# EAGLE schematic T2008_thermometre (EAGLE 9.6.2)
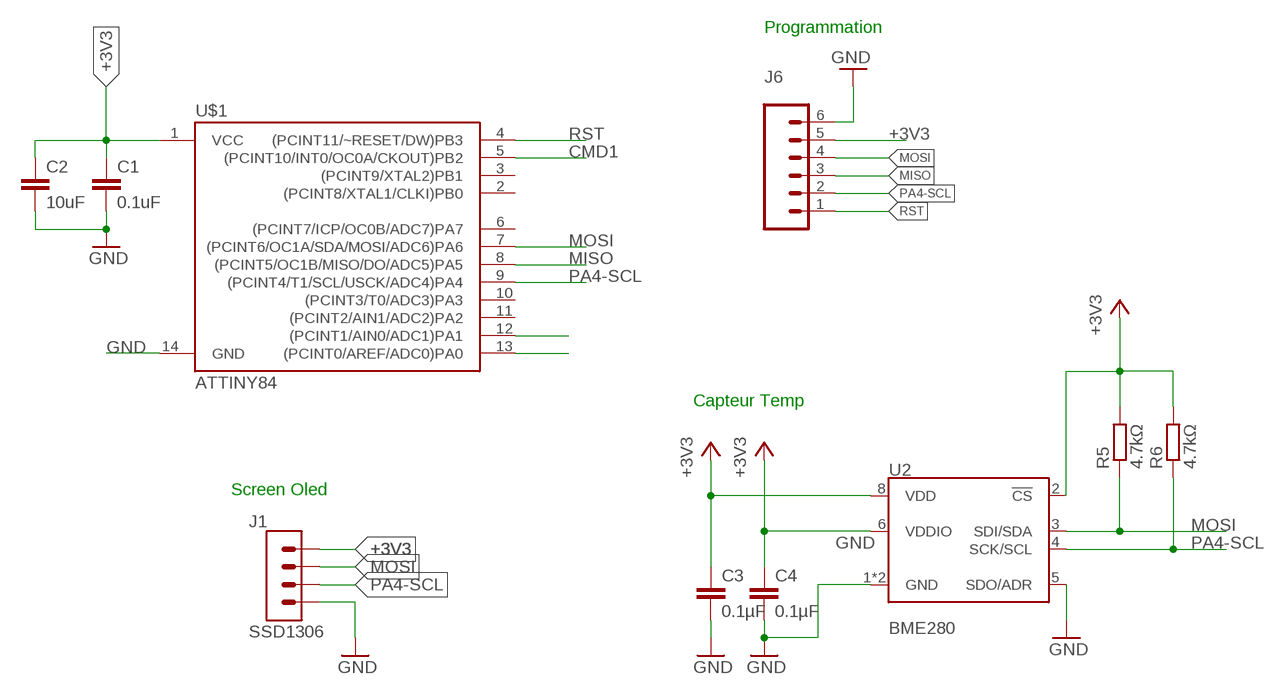
[diagram p0: schematic, sheet 1]

## Parts
C1  0.1uF  C-EUC0603K  [C0603K]
C2  10uF  C-EUC0603K  [C0603K]
C3  0.1µF  C-EUC0603K  [C0603K]
C4  0.1µF  C-EUC0603K  [C0603K]
J1  SSD1306  62000411121  [62000411121]
J6  CONN_06SMD_MALE  [1X06_SMD_MALE]
R5  4.7kΩ  R-EU_R0603  [R0603]
R6  4.7kΩ  R-EU_R0603  [R0603]
U2  BME280  [LGA-8-2.5X2.5]
U$1  ATTINY84  [SO14]

## Nets
+3V3 [vcc5]: C1.1 C2.1 C3.1 C4.1 J1.1 J6.5 R5.2 R6.2 U2.2(!CS) U2.6(VDDIO) U2.8(VDD) U$1.1(VCC)
CMD1: U$1.5((PCINT10/INT0/OC0A/CKOUT)PB2)
GND [gnd]: C1.2 C2.2 C3.2 C4.2 J1.4 J6.6 U2.1(GND) U2.5(SDO/ADR) U2.7(GND) U$1.14(GND)
MISO: J6.3 U$1.8((PCINT5/OC1B/MISO/DO/ADC5)PA5)
MOSI: J1.2 J6.4 R5.1 U2.3(SDI/SDA) U$1.7((PCINT6/OC1A/SDA/MOSI/ADC6)PA6)
N$4: U$1.13((PCINT0/AREF/ADC0)PA0)
N$5: U$1.12((PCINT1/AIN0/ADC1)PA1)
PA4-SCL: J1.3 J6.2 R6.1 U2.4(SCK/SCL) U$1.9((PCINT4/T1/SCL/USCK/ADC4)PA4)
RST: J6.1 U$1.4((PCINT11/~RESET/DW)PB3)
Unconnected: U$1.2((PCINT8/XTAL1/CLKI)PB0) U$1.3((PCINT9/XTAL2)PB1) U$1.6((PCINT7/ICP/OC0B/ADC7)PA7) U$1.10((PCINT3/T0/ADC3)PA3) U$1.11((PCINT2/AIN1/ADC2)PA2)

## Notes on the sheet
- Programmation
- Capteur Temp
- Screen Oled

## Library data of the parts
C1 C2 = resistor:C-EU: CAPACITOR, European symbol
C3 C4 = rcl:C-EU: CAPACITOR, European symbol; SPICEPREFIX: C
J1 = Headers:62000411121: THT Vertical Pin Header WR-PHD, Pitch 2.00 mm, Single Row, 4 pins Manufacturer's datasheet <https://datasheet.octopart.com/62000411121-W%C3%BCrth-Elektronik-datasheet-117282003.pdf>; CREATED_BY: PCBLayout.com; MANUFACTURER: Würth Elektronik; MPN: 62000411121
J6 = SparkFun-Connectors:CONN_06: Multi connection point. Often used as Generic Header-pin footprint for 0.1 inch spaced/style header connections On any of the 0.1 inch spaced packages, you can populate with these: Break Away Headers - Straight <https://www.sparkfun.com/products/116> (PRT-00116) Break Away Male Headers - Right Angle <https://www.sparkfun.com/products/553> (PRT-00553) Female Headers <https://www.sparkfun.com/products/115> (PRT-00115) Break Away Headers - Machine Pin <https://www.sparkfun.com/products/117> (PRT-00117) Break Away Female Headers - Swiss Machine Pin <https://www.sparkfun.com/products/743> (PRT-00743) Arduino Stackable Header - 6 Pin <https://www.sparkfun.com/products/9280> (PRT-09280) For SCREWTERMINALS and SPRING TERMINALS visit here: Screw Terimnals on SparkFun.com <https://www.sparkfun.com/search/results?term=Screw+Terminals> (5mm/3.5mm/2.54mm spacing) This device is also useful as a general connection point to wire up your design to another part of your project. Our various solder wires solder well into these plated through hole pads. Hook-Up Wire - Assortment (Stranded, 22 AWG) <https://www.sparkfun.com/products/11375> (PRT-11375) Hook-Up Wire - Assortment (Solid Core, 22 AWG) <https://www.sparkfun.com/products/11367> (PRT-11367) View the entire wire category on our website here <https://www.sparkfun.com/categories/141>; PROD_ID: CONN-11293
R5 R6 = rcl:R-EU_: RESISTOR, European symbol; SPICEPREFIX: R
U2 = SparkFun-Sensors:BME280: Bosch BME280 – Combined Humidity and Pressure Sensor The BME280 is as combined digital humidity, pressure and temperature sensor based on proven sensing principles. The sensor module is housed in an extremely compact metal-lid LGA package with a footprint of only 2.5×2.5mm² with a height of 0.93mm. Its small dimensions and its low power consumption allow the implementation in battery driven devices such as handsets, GPS modules or watches. Datasheet <https://cdn.sparkfun.com/assets/learn_tutorials/4/1/9/BST-BME280_DS001-10.pdf> SparkFun Products SparkFun Atmospheric Sensor Breakout - BME280 <https://www.sparkfun.com/products/13676> (SEN-13676); PROD_ID: IC-13090
U$1 = Fidget Spinner Example:ATTINY84: Atmel 14-pin 2/4/8kB flash uC Datasheet <https://cdn.sparkfun.com/datasheets/Widgets/doc8006.pdf> SparkFun Products Tiny AVR Programmer <https://www.sparkfun.com/products/11801> (PGM-11801) SparkFun Servo Trigger - Continuous Rotation <https://www.sparkfun.com/products/13872> (WIG-13872) SparkFun Servo Trigger <https://www.sparkfun.com/products/13118> (WIG-13118); PROD_ID: IC-11285

## Net classes
1 gnd: width 0.7 mm, drill 0.305 mm, clearance 0.205 mm to class 0, clearance 0.205 mm
2 vcc: width 0.7 mm, drill 0.305 mm, clearance 0.205 mm to class 0, clearance 0.205 mm to class 1, clearance 0.205 mm
3 vcc5: width 0.512 mm, drill 0.205 mm, clearance 0.205 mm to class 0, clearance 0.205 mm to class 1, clearance 0.205 mm to class 2, clearance 0.205 mm